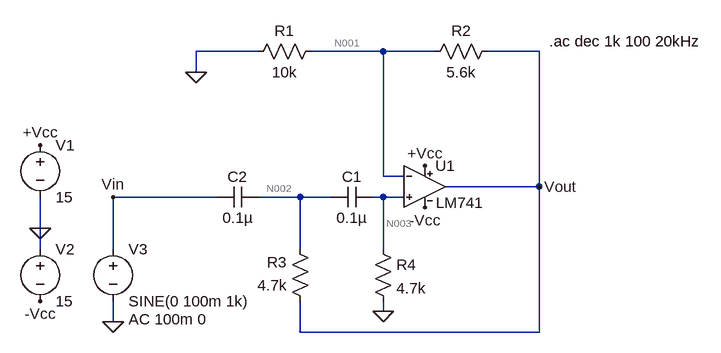
[diagram p0: schematic HighPassFilter.asc]
HighPassFilter.asc, the LTspice schematic file:
Version 4
SHEET 1 880 680
WIRE 112 -80 16 -80
WIRE 304 -80 192 -80
WIRE 384 -80 304 -80
WIRE 544 -80 464 -80
WIRE 16 -48 16 -80
WIRE 304 112 304 -80
WIRE 336 112 304 112
WIRE 544 128 544 -80
WIRE 544 128 400 128
WIRE 48 144 -112 144
WIRE 176 144 112 144
WIRE 224 144 176 144
WIRE 304 144 288 144
WIRE 336 144 304 144
WIRE -224 192 -224 144
WIRE -224 224 -224 192
WIRE -112 224 -112 144
WIRE 176 224 176 144
WIRE 304 224 304 144
WIRE 304 320 304 304
WIRE -112 336 -112 304
WIRE 176 352 176 304
WIRE 544 352 544 128
WIRE 544 352 176 352
FLAG -224 192 0
FLAG -224 64 +Vcc
FLAG -224 304 -Vcc
FLAG -112 336 0
FLAG 304 320 0
FLAG 16 -48 0
FLAG 368 96 +Vcc
FLAG 368 160 -Vcc
FLAG 544 128 Vout
FLAG -112 144 Vin
SYMBOL LM741 368 64 R0
SYMATTR InstName U1
SYMBOL voltage -224 208 R0
WINDOW 123 0 0 Left 0
WINDOW 39 0 0 Left 0
SYMATTR InstName V2
SYMATTR Value 15
SYMBOL voltage -224 48 R0
WINDOW 123 0 0 Left 0
WINDOW 39 0 0 Left 0
SYMATTR InstName V1
SYMATTR Value 15
SYMBOL voltage -112 208 R0
WINDOW 123 24 124 Left 2
WINDOW 39 0 0 Left 0
SYMATTR Value2 AC 100m 0
SYMATTR InstName V3
SYMATTR Value SINE(0 100m 1k)
SYMBOL cap 112 128 R90
WINDOW 0 0 32 VBottom 2
WINDOW 3 32 32 VTop 2
SYMATTR InstName C2
SYMATTR Value 0.1µ
SYMBOL cap 288 128 R90
WINDOW 0 0 32 VBottom 2
WINDOW 3 32 32 VTop 2
SYMATTR InstName C1
SYMATTR Value 0.1µ
SYMBOL res 192 320 R180
WINDOW 0 36 76 Left 2
WINDOW 3 36 40 Left 2
SYMATTR InstName R3
SYMATTR Value 4.7k
SYMBOL res 288 208 R0
WINDOW 0 36 40 Left 2
WINDOW 3 36 76 Left 2
SYMATTR InstName R4
SYMATTR Value 4.7k
SYMBOL res 480 -96 R90
WINDOW 0 0 56 VBottom 2
WINDOW 3 32 56 VTop 2
SYMATTR InstName R2
SYMATTR Value 5.6k
SYMBOL res 208 -96 R90
WINDOW 0 0 56 VBottom 2
WINDOW 3 32 56 VTop 2
SYMATTR InstName R1
SYMATTR Value 10k
TEXT 560 -96 Left 2 !.ac dec 1k 100 20kHz

The netlist it stands for:
* HighPassFilter.asc
XU1 N003 N001 +Vcc -Vcc Vout LM741  ; pins In+ In- V+ V- OUT
V2 0 -Vcc 15
V1 +Vcc 0 15
V3 Vin 0 SINE(0 100m 1k) AC 100m 0
C2 N002 Vin 0.1µ
C1 N003 N002 0.1µ
R3 Vout N002 4.7k
R4 N003 0 4.7k
R2 Vout N001 5.6k
R1 N001 0 10k
.ac dec 1k 100 20kHz
.lib LM741.lib
.backanno
.end

* Results of the author's LTspice run, read from the files saved beside the schematic
* Operating Point, zero values left out:
*   V(n001) = 728.1 µV
*   V(n003) = -271.9 µV
*   V(-vcc) = -15 V
*   V(+vcc) = 15 V
*   V(vout) = 1.706 mV
*   V(n002) = 1.706 mV
*   I(R1) = 72.81 nA
*   I(R2) = 174.7 nA
*   I(R4) = -57.86 nA
*   I(V1) = -1.701 mA
*   I(V2) = -1.701 mA
*   Ix(u1:1) = 57.86 nA
*   Ix(u1:2) = 101.9 nA
*   Ix(u1:99) = 1.701 mA
*   Ix(u1:50) = -1.701 mA
*   Ix(u1:28) = -174.7 nA
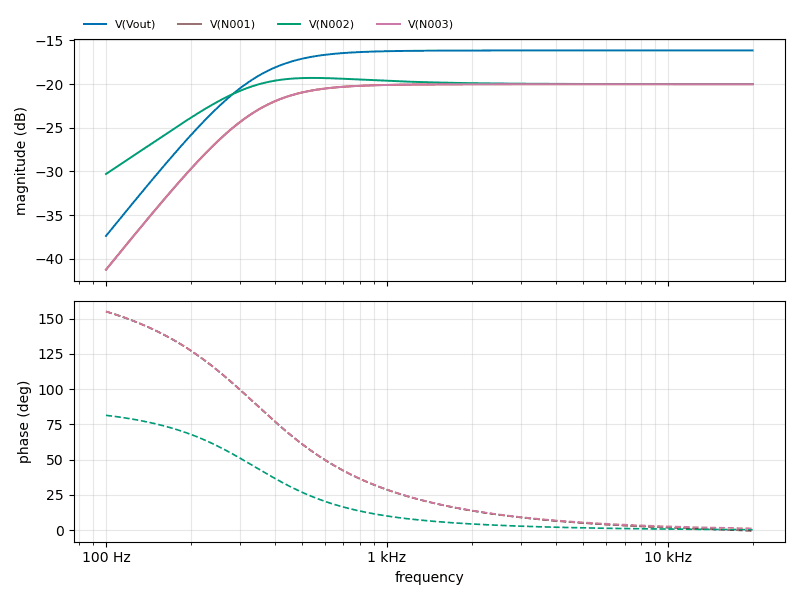
[diagram p1: AC Analysis of HighPassFilter.asc, plotted from the saved traces]
* AC Analysis, 1 run:
*   V(Vout): -37.39 dB at 100 Hz, -16.15 dB at 20 kHz, peak -16.15 dB at 9.204 kHz, 3 dB below the peak at 344.6 Hz
*   V(N001): -41.25 dB at 100 Hz, -20.01 dB at 20 kHz, peak -20.01 dB at 9.162 kHz, 3 dB below the peak at 344.6 Hz
*   V(N002): -30.29 dB at 100 Hz, -20.01 dB at 20 kHz, peak -19.30 dB at 543.3 Hz, 3 dB below the peak at 240.6 Hz
*   V(N003): -41.25 dB at 100 Hz, -20.01 dB at 20 kHz, peak -20.01 dB at 20 kHz, 3 dB below the peak at 344.6 Hz